# EAGLE schematic fanctrl (EAGLE 7.7.0)
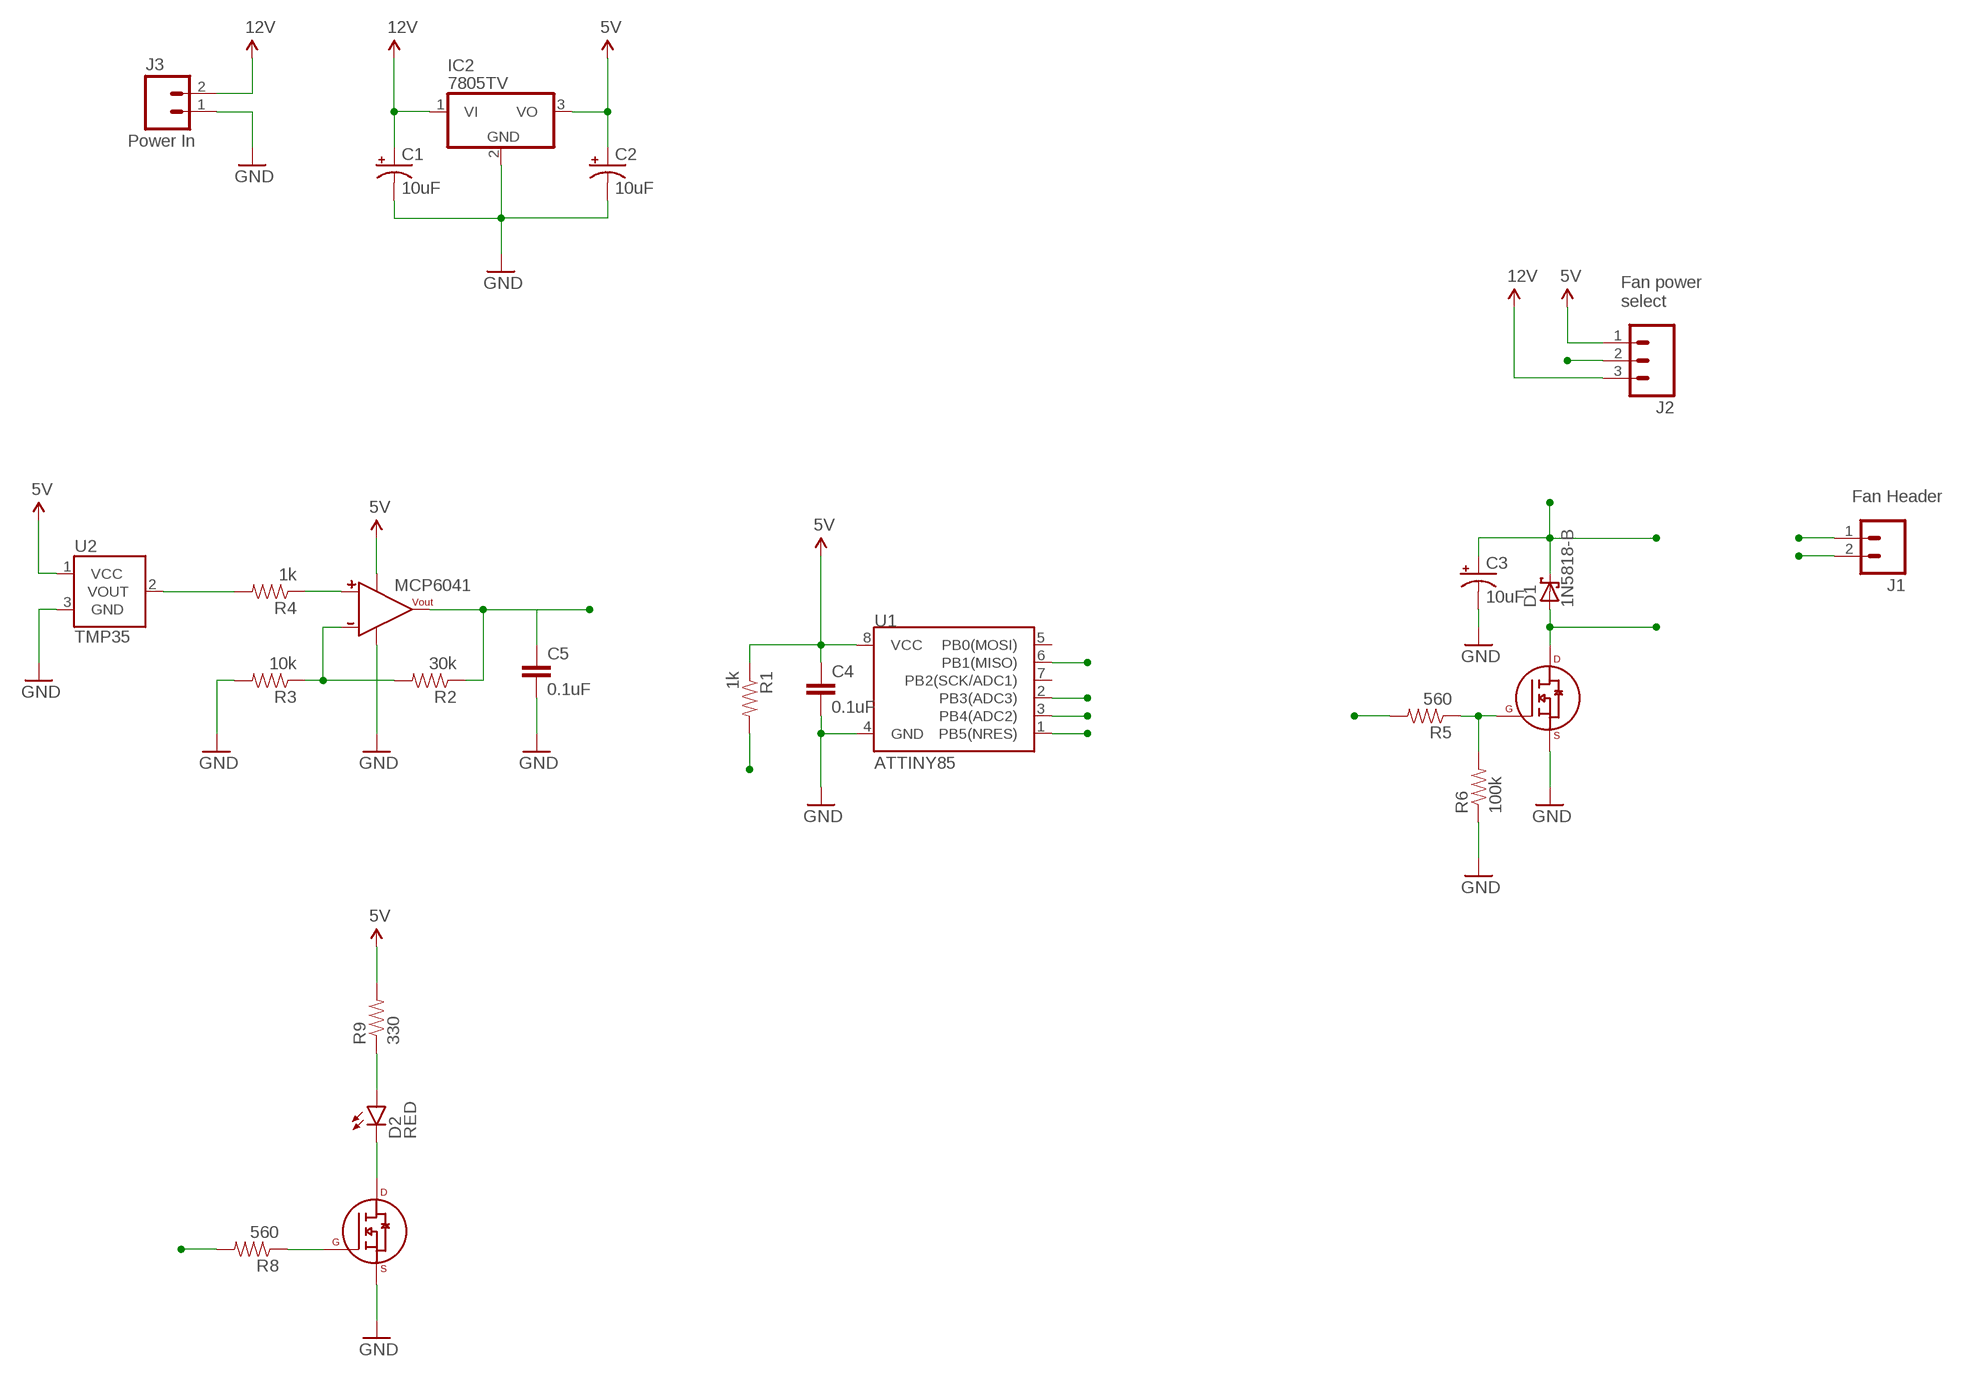
[diagram p0: schematic, sheet 1]

## Parts
C1  10uF  10UF-25V-20%(PTH)  [CPOL-RADIAL-10UF-25V]
C2  10uF  10UF-25V-20%(PTH)  [CPOL-RADIAL-10UF-25V]
C3  10uF  10UF-25V-20%(PTH)  [CPOL-RADIAL-10UF-25V]
C4  0.1uF  CAPEZ  [CAP-PTH-SMALLEZ]
C5  0.1uF  CAPEZ  [CAP-PTH-SMALLEZ]
D1  1N5818-B  [DO41-7.6]
D2  RED  LED5MM  [LED5MM]
IC2  7805TV  [TO220V]
J1  M02JST-PTH-VERT  [JST-2-PTH-VERT]
J2  M03PTH  [1X03]
J3  M02PTH  [1X02]
MCP6041  MCP6041DIP  [PDIP-8]
R1  1k  RESISTORPTH-1/4W-VERT  [AXIAL-0.1]
R2  30k  RESISTORPTH-1/4W-VERT  [AXIAL-0.1]
R3  10k  RESISTORPTH-1/4W-VERT  [AXIAL-0.1]
R4  1k  RESISTORPTH-1/4W-VERT  [AXIAL-0.1]
R5  560  RESISTORPTH-1/4W-VERT  [AXIAL-0.1]
R6  100k  RESISTORPTH-1/4W-VERT  [AXIAL-0.1]
R8  560  RESISTORPTH-1/4W-VERT  [AXIAL-0.1]
R9  330  RESISTORPTH-1/4W-VERT  [AXIAL-0.1]
U1  ATTINY85  ATTINY45TINY45-20-DIP  [DIP08]
U2  TMP35  TMP36GT9  [TO-92]
U$1  2N7000  2N7000-2TO-92  [TO-92]
U$2  2N7000  2N7000-2TO-92  [TO-92]

## Nets
5V: C2.1(+) C4.1 IC2.3(VO) J2.1 MCP6041.7(VDD) R1.P$1 R9.P$2 U1.8(VCC) U2.1(VCC)
12V: C1.1(+) IC2.1(VI) J2.3 J3.2
/RESET: R1.P$2 U1.1(PB5(NRES))
FAN_POWER: C3.1(+) D1.C J1.1 J2.2
GND: C1.2(-) C2.2(-) C3.2(-) C4.2 C5.2 IC2.2(GND) J3.1 MCP6041.4(VSS) R3.P$2 R6.P$1 U1.4(GND) U2.3(GND) U$1.3(S) U$2.3(S)
LED: R8.P$2 U1.3(PB4(ADC2))
MOTOR-: D1.A J1.2 U$1.1(D)
N$1: R4.P$2 U2.2(VOUT)
N$2: MCP6041.2(-) R2.P$2 R3.P$1
N$3: R5.P$1 R6.P$2 U$1.2(G)
N$4: MCP6041.3(+) R4.P$1
N$5: D2.A R9.P$1
N$6: D2.K(C) U$2.1(D)
N$7: R8.P$1 U$2.2(G)
PWM: R5.P$2 U1.6(PB1(MISO))
SENSOR: C5.1 MCP6041.6(VOUT) R2.P$1 U1.2(PB3(ADC3))
Unconnected: U1.5(PB0(MOSI)) U1.7(PB2(SCK/ADC1))

## Notes on the sheet
- Power In
- Fan power
  select
- Fan Header
- MCP6041

## Library data of the parts
C1-C3 = SparkFun-Capacitors:10UF-25V-20%(PTH): CAP-08440; PROD_ID: CAP-08440
C4 C5 = SparkFun-Capacitors:CAP: Capacitor Standard 0603 ceramic capacitor, and 0.1" leaded capacitor.
D1 = diode:1N581*: 1.0A SCHOTTKY BARRIER RECTIFIER Source: http://www.diodes.com/datasheets/ds23001.pdf
D2 = SparkFun-LED:LED: LEDs Standard schematic elements and footprints for 5mm, 3mm, 1206, and 0603 sized LEDs. 5mm - Spark Fun Electronics SKU : COM-00529 (and others)
IC2 = linear:78*: Positive VOLTAGE REGULATOR Source: http://cache.national.com/ds/LM/LM78L05.pdf http://www.fairchildsemi.com/ds/LM/LM7805.pdf
J1 J3 = SparkFun-Connectors:M02: Standard 2-pin 0.1" header. Use with - straight break away headers ( PRT-00116) - right angle break away headers (PRT-00553) - swiss pins (PRT-00743) - machine pins (PRT-00117) - female headers (PRT-00115) Molex polarized connector foot print use with: PRT-08233 with associated crimp pins and housings. 2.54_SCREWTERM for use with PRT-10571. 3.5mm Screw Terminal footprints for PRT-08084 5mm Screw Terminal footprints for use with PRT-08432
J2 = SparkFun-Connectors:M03: Header 3 Standard 3-pin 0.1" header. Use with straight break away headers (SKU : PRT-00116), right angle break away headers (PRT-00553), swiss pins (PRT-00743), machine pins (PRT-00117), and female headers (PRT-00115). Molex polarized connector foot print use with SKU : PRT-08232 with associated crimp pins and housings.
MCP6041 = Synapseware:MCP6041: 600 nA, Rail-to-Rail Input/Output Op Amp
R1-R6 R8 R9 = SparkFun-Resistors:RESISTOR: Resistor Basic schematic elements and footprints for 0603, 1206, and PTH resistors.
U1 = SparkFun-DigitalIC:ATTINY45: Atmel 8-pin 2/4/8kB flash uC; PROD_ID: IC-09439; VALUE: TINY45-20-DIP
U2 = SparkFun-Sensors:TMP36: Precision degC temp sensor, analog out
U$1 U$2 = Synapseware:2N7000-2: N-Channel Enhancement Mode Field Effect Transistor